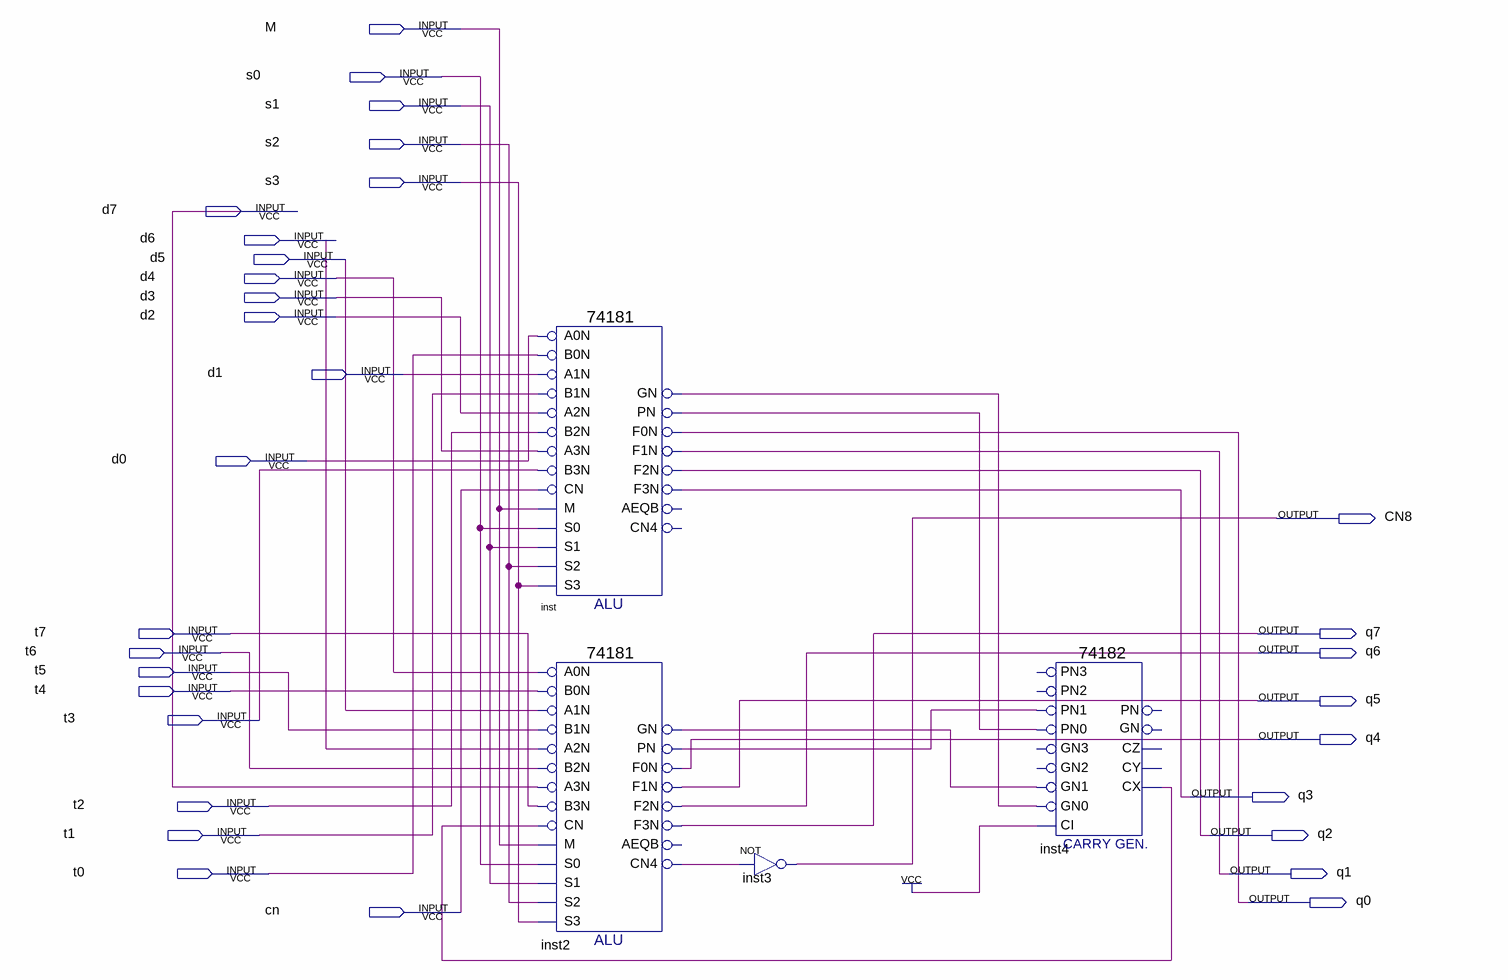
[diagram p0: schematic sheet]
// Quartus schematic ALU--8.bdf as structural Verilog: 4 symbols, 31 pins
module \ALU--8  (
  input  M,
  input  s0,
  input  s1,
  input  s2,
  input  s3,
  input  d7,
  input  d6,
  input  d5,
  input  d4,
  input  d3,
  input  d2,
  input  d1,
  input  d0,
  input  t7,
  input  t6,
  input  t5,
  input  t4,
  input  t3,
  input  t2,
  input  t1,
  input  t0,
  input  cn,
  output CN8,
  output q7,
  output q6,
  output q5,
  output q4,
  output q3,
  output q2,
  output q1,
  output q0
);

  wire inst2_cn4, inst2_gn, inst2_pn, inst4_cx, inst_gn, inst_pn;

  \74181  inst (
    .B0N(t0), .A0N(d0), .A1N(d1), .B1N(t1), .A3N(d3), .B2N(t2), .A2N(d2), .M(M), .CN(cn), .B3N(t3), .S2(s2),
    .S1(s1), .S0(s0), .S3(s3), .PN(inst_pn), .GN(inst_gn), .F3N(q3), .F1N(q1), .F0N(q0), .F2N(q2));  // open: AEQB, CN4
  \74181  inst2 (
    .B0N(t4), .A0N(d4), .A1N(d5), .B1N(t5), .A3N(d7), .B2N(t6), .A2N(d6), .M(M), .CN(inst4_cx), .B3N(t7),
    .S2(s2), .S1(s1), .S0(s0), .S3(s3), .PN(inst2_pn), .GN(inst2_gn), .F3N(q7), .F1N(q5), .F0N(q4),
    .CN4(inst2_cn4), .F2N(q6));  // open: AEQB
  not inst3 (CN8, inst2_cn4);
  \74182  inst4 (
    .CI(1'b1), .PN1(inst2_pn), .PN0(inst_pn), .GN1(inst2_gn), .GN0(inst_gn), .CX(inst4_cx));  // open: PN2, GN2, GN3, PN3, CY, PN, CZ, GN
endmodule
